# EAGLE design MCU_PCB_V2 (EAGLE 9.5.2)
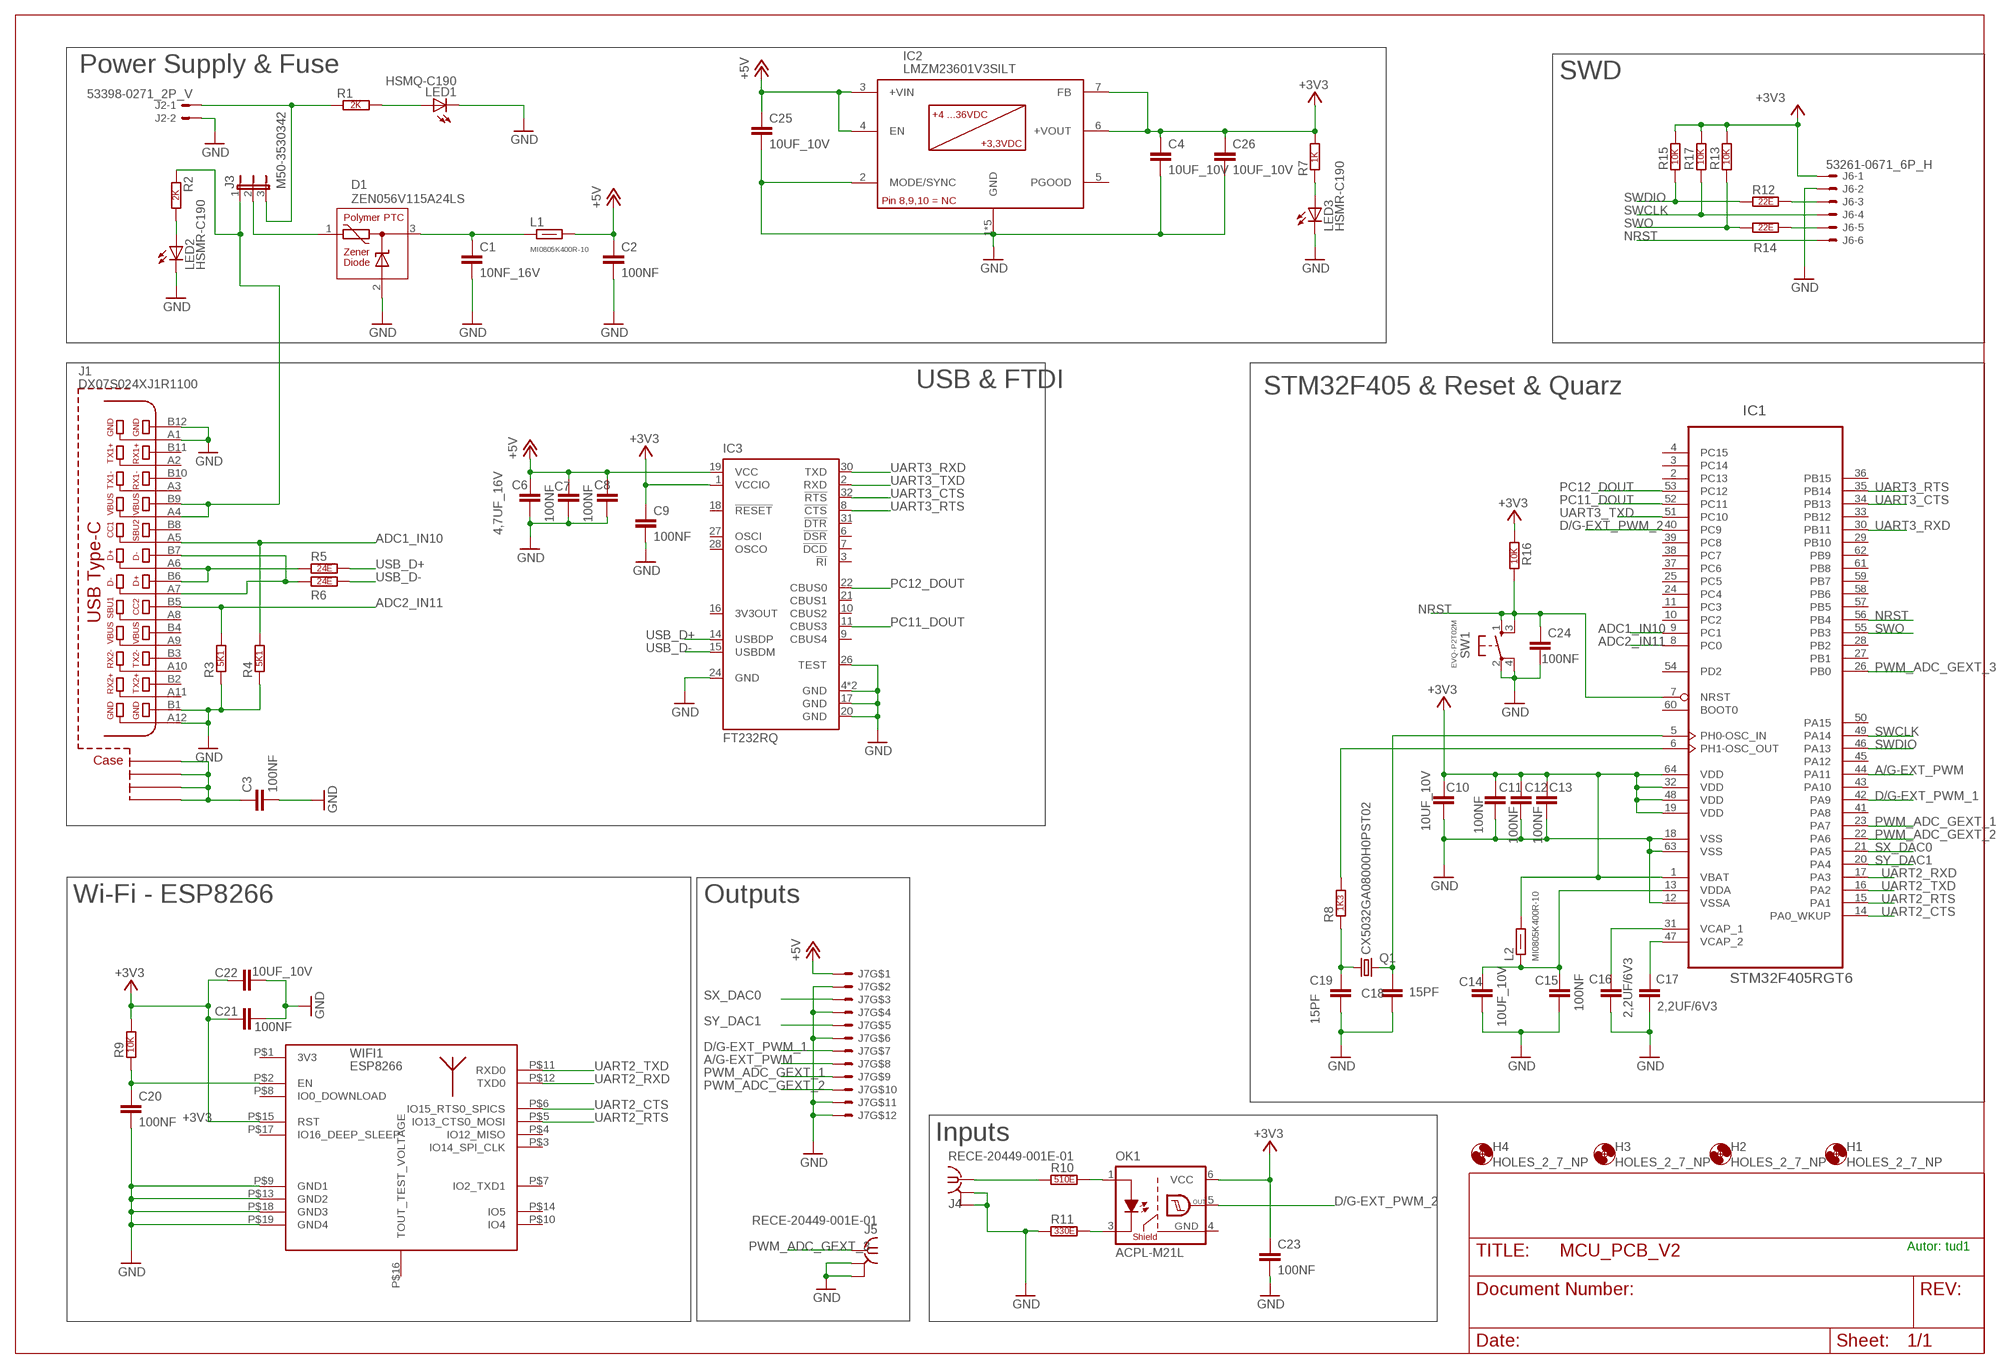
[diagram p0: schematic, sheet 1]

## Parts
C1  10NF_16V  [C0603]
C2  100NF  [C0402]
C3  100NF  [C0402]
C4  10UF_10V  [C0603]
C6  4,7UF_16V  [C0603]
C7  100NF  [C0402]
C8  100NF  [C0402]
C9  100NF  [C0402]
C10  10UF_10V  [C0603]
C11  100NF  [C0402]
C12  100NF  [C0402]
C13  100NF  [C0402]
C14  10UF_10V  [C0603]
C15  100NF  [C0402]
C16  2,2UF/6V3  [C0402]
C17  2,2UF/6V3  [C0402]
C18  15PF  [C0402]
C19  15PF  [C0402]
C20  100NF  [C0402]
C21  100NF  [C0402]
C22  10UF_10V  [C0603]
C23  100NF  [C0402]
C24  100NF  [C0402]
C25  10UF_10V  [C0603]
C26  10UF_10V  [C0603]
D1  ZEN056V115A24LS  [1616_LS]
H1  HOLES_2_7_NP  [2_7_NP]
H2  HOLES_2_7_NP  [2_7_NP]
H3  HOLES_2_7_NP  [2_7_NP]
H4  HOLES_2_7_NP  [2_7_NP]
IC1  STM32F405RGT6  [LQFP-64]
IC2  LMZM23601V3SILT  [USIP-10]
IC3  FT232RQ  [QFN32]
J1  DX07S024XJ1R1100  [USB-TYPE_C_JAE]
J2  53398-0271_2P_V  [53398-02]
J3  M50-3530342  [M50-3530342]
J4  RECE-20449-001E-01  [IPEX_MHF4]
J5  RECE-20449-001E-01  [IPEX_MHF4]
J6  53261-0671_6P_H  [53261-06]
J7  53261-7010_10P_H  [53261-10]
L1  MI0805K400R-10  [F0805]
L2  MI0805K400R-10  [F0805]
LED1  HSMQ-C190  [CHIP-LED-0603]
LED2  HSMR-C190  [CHIP-LED-0603]
LED3  HSMR-C190  [CHIP-LED-0603]
OK1  ACPL-M21L  [SO-5]
Q1  CX5032GA08000H0PST02  [CX5032GA]
R1  2K  [R0603]
R2  2K  [R0603]
R3  5K1  [R0603]
R4  5K1  [R0603]
R5  24E  [R0402]
R6  24E  [R0402]
R7  1K  [R0603]
R8  1K3  [R0402]
R9  10K  [R0402]
R10  510E  [R0402]
R11  330E  [R0402]
R12  22E  [R0402]
R13  10K  [R0402]
R14  22E  [R0402]
R15  10K  [R0402]
R16  10K  [R0402]
R17  10K  [R0402]
SW1  EVQ-P2T02M  [EVQ-P2T02M]
WIFI1  ESP8266  [ESP8266]

## Nets
+3V3: C4.1 C9.1 C10.1 C11.1 C12.1 C13.1 C21.1 C22.1 C23.1 C26.1 IC1.1(VBAT) IC1.19(VDD) IC1.32(VDD) IC1.48(VDD) IC1.64(VDD) IC2.6(+VOUT) IC2.7(FB) IC3.1(VCCIO) J6.1 L2.2 OK1.6(VCC) R7.2 R9.2 R13.2 R15.2 R16.1 R17.2 WIFI1.P$15(RST)
+5V: C2.1 C6.1 C7.1 C8.1 C25.1 IC2.3(+VIN) IC2.4(EN) IC3.19(VCC) J7.1 L1.2
A/G-EXT_PWM: IC1.44(PA11) J7.8
ADC1_IN10: IC1.9(PC1) J1.A5 R4.2
ADC2_IN11: IC1.8(PC0) J1.B5 R3.2
D/G-EXT_PWM_1: IC1.42(PA9) J7.7
D/G-EXT_PWM_2: IC1.40(PC9) OK1.5(OUT)
GND: C1.2 C2.2 C3.2 C4.2 C6.2 C7.2 C8.2 C9.2 C10.2 C11.2 C12.2 C13.2 C14.2 C15.2 C16.2 C17.2 C18.2 C19.2 C20.2 C21.2 C22.2 C23.2 C24.2 C25.2 C26.2 D1.2(GND) IC1.12(VSSA) IC1.18(VSS) IC1.63(VSS) IC2.1(GND) IC2.2(MODE/SYNC) IC2.GND@1(GND) IC2.GND@2(GND) IC2.GND@3(GND) IC2.GND@4(GND) IC3.4(GND) IC3.17(GND) IC3.20(GND) IC3.24(GND) IC3.26(TEST) IC3.GND@3(GND) J1.A1 J1.A12 J1.B1 J1.B12 J2.2 J4.2@1(GND) J4.2@2(GND) J4.NC(GND) J5.2@1(GND) J5.2@2(GND) J5.NC(GND) J6.2 J7.2 J7.4 J7.6 J7.S1 J7.S2 LED1.C LED2.C LED3.C R3.1 R4.1 R11.1 SW1.2(S) SW1.4(S) WIFI1.P$9(GND1) WIFI1.P$13(GND2) WIFI1.P$18(GND3) WIFI1.P$19(GND4)
N$1: J2.1 J3.3 R1.1
N$2: LED1.A R1.2
N$3: D1.1(VIN) J3.2
N$4: C1.1 D1.3(VOUT) L1.1
N$6: LED2.A R2.2
N$7: C16.1 IC1.31(VCAP_1)
N$9: J1.A6 J1.B6 R5.1
N$10: C17.1 IC1.47(VCAP_2)
N$11: C3.1 J1.C_FLEFT(S3) J1.C_FRIGHT(S1) J1.C_RLEFT(S4) J1.C_RRIGHT(S2)
N$12: J1.A7 J1.B7 R6.1
N$13: LED3.A R7.1
N$14: OK1.3(C) R11.2
N$15: C14.1 C15.1 IC1.13(VDDA) L2.1
N$16: C19.1 Q1.1 R8.1
N$17: C18.1 IC1.5(PH0-OSC_IN) Q1.2
N$18: OK1.1(A) R10.2
N$19: J1.A4 J1.B9 J3.1 R2.1
N$20: IC1.6(PH1-OSC_OUT) R8.2
N$21: J4.1 R10.1
N$23: J6.3 R12.2
N$25: J6.5 R14.2
NRST: C24.1 IC1.7(NRST) IC1.56(PB4) J6.6 R16.2 SW1.1(P) SW1.3(P)
PC11_DOUT: IC1.52(PC11) IC3.11(CBUS3)
PC12_DOUT: IC1.53(PC12) IC3.22(CBUS0)
PWM_ADC_GEXT_1: IC1.23(PA7) J7.9
PWM_ADC_GEXT_2: IC1.22(PA6) J7.10
PWM_ADC_GEXT_3: IC1.26(PB0) J5.1
SWCLK: IC1.49(PA14) J6.4 R17.1
SWDIO: IC1.46(PA13) R12.1 R15.1
SWO: IC1.55(PB3) R13.1 R14.1
SX_DAC0: IC1.21(PA5) J7.3
SY_DAC1: IC1.20(PA4) J7.5
UART2_CTS: IC1.14(PA0_WKUP) WIFI1.P$6(IO15_RTS0_SPICS)
UART2_RTS: IC1.15(PA1) WIFI1.P$5(IO13_CTS0_MOSI)
UART2_RXD: IC1.17(PA3) WIFI1.P$12(TXD0)
UART2_TXD: IC1.16(PA2) WIFI1.P$11(RXD0)
UART3_CTS: IC1.34(PB13) IC3.32(!RTS)
UART3_RTS: IC1.35(PB14) IC3.8(!CTS)
UART3_RXD: IC1.30(PB11) IC3.30(TXD)
UART3_TXD: IC1.51(PC10) IC3.2(RXD)
USB_D+: IC3.14(USBDP) R5.2
USB_D-: IC3.15(USBDM) R6.2
WIFI_RST: C20.1 R9.1 WIFI1.P$2(EN)
Unconnected: IC1.2(PC13) IC1.3(PC14) IC1.4(PC15) IC1.10(PC2) IC1.11(PC3) IC1.24(PC4) IC1.25(PC5) IC1.27(PB1) IC1.28(PB2) IC1.29(PB10) IC1.33(PB12) IC1.36(PB15) IC1.37(PC6) IC1.38(PC7) IC1.39(PC8) IC1.41(PA8) IC1.43(PA10) IC1.45(PA12) IC1.50(PA15) IC1.54(PD2) IC1.57(PB5) IC1.58(PB6) IC1.59(PB7) IC1.60(BOOT0) IC1.61(PB8) IC1.62(PB9) IC2.5(PGOOD) IC2.8(NC) IC2.9(NC) IC2.10(NC) IC3.3(!RI) IC3.6(!DSR) IC3.7(!DCD) IC3.9(CBUS4) IC3.10(CBUS2) IC3.16(3V3OUT) IC3.18(!RESET) IC3.21(CBUS1) IC3.27(OSCI) IC3.28(OSCO) IC3.31(!DTR) J1.A2 J1.A3 J1.A8 J1.A9 J1.A10 J1.A11 J1.B2 J1.B3 J1.B4 J1.B8 J1.B10 J1.B11 WIFI1.P$1(3V3) WIFI1.P$3(IO14_SPI_CLK) WIFI1.P$4(IO12_MISO) WIFI1.P$7(IO2_TXD1) WIFI1.P$8(IO0_DOWNLOAD) WIFI1.P$10(IO4) WIFI1.P$14(IO5) WIFI1.P$16(TOUT_TEST_VOLTAGE) WIFI1.P$17(IO16_DEEP_SLEEP)

## Notes on the sheet
- Power Supply & Fuse | SWD
- USB & FTDI | STM32F405 & Reset & Quarz
- Wi-Fi - ESP8266 | Outputs
- Inputs
- Autor: tud1

## Power pins joined to a net without a drawn wire
GND: OK1.4(GND)

## Library data of the parts
C1 = MCU_Print_V2:10NF_16V: Multilayer ceramic capacitor SMD, 10nF ±10%, 16VDC, X7R, Kemet, Case 0603, Mouser: 80-C0603C103K4RACTM; CASE: 0603; CERAMIC: X7R; MANUFACTURER: Kemet; MOUSER: 80-C0603C103K4RACTM; OPERATING_TEMPERATURE_RANGE: -55°C ~ 125°C; TOLERANCE: ±10%; TYPE: C0603C103K4RACTM; U_NOM: 16V
C2 C3 C7-C9 C11-C13 C15 C20 C21 C23 C24 = MCU_Print_V2:100NF: Ceramic capacitor SMD 100nF ±5%, 16VDC, X7R, Kemet, Case 0402, C0402C104J4RACTU, MLCC, Mouser: 80-C0402C104J4R; CASE: 0402; CERAMIC: X7R; FARNELL: 2429353; MANUFACTURER: Kemet; MOUSER: 80-C0402C104J4R; OPERATING-TEMPERATURE-RANGE: -55...+125 °C; PRODUCT: General Type MLCCs; TOLERANCE: ±5%; TYPE: C0402C104J4RACTU; U-NOM: 16VDC
C4 C10 C14 C22 C25 C26 = MCU_Print_V2:10UF_10V: Ceramic capacitor SMD 10uF ±10%, 10VDC, X5R, TDK , Case 0603, Mouser: 810-C1608X5R1A106K; CASE: 0603; CERAMIC: X5R; DIGI-KEY: 445-7486-1-ND; FARNELL: 2211164; MANUFACTURER: TDK; MOUSER: 810-C1608X5R1A106K; OPERATING_TEMPERATURE_RANGE: -55°C ~ 85°C; TOLERANCE: ±10%; TYPE: C1608X5R1A106K080AC; U_NOM: 10V
C6 = MCU_Print_V2:4,7UF_16V: Multilayer Ceramic Capacitors MLCC, SMD 4,7uF ±10%, 16VDC, X5R, YAGEO , Case 0603, Mouser: 603-CC603KRX5R7BB475; CASE: 0603; CERAMIC: X5R; DIGI-KEY: 311-1785-2-ND; MANUFACTURER: Yageo; MOUSER: 603-CC603KRX5R7BB475; OPERATING_TEMPERATURE_RANGE: -55°C ~ 85°C; TOLERANCE: ±10%; TYPE: CC0603KRX5R7BB475; U_NOM: 16V
C16 C17 = MCU_Print_V2:2,2UF/6V3: Multilayer Ceramic Capacitors MLCC, SMD, 2,2uF ±10%, 6,3VDC, X5R, Kemet, Case 0402, Mouser: 80-C0402C225K9P; CASE: 0402; CERAMIC: X5R; DISTRELEC: 110-95-530; FARNELL: 2442787; MANUFACTURER: Kemet; MOUSER: 80-C0402C225K9P; OPERATING-TEMPERATURE-RANGE: -55...+85 °C; PRODUCT: Multilayer Ceramic Capacitors MLCC; TOLERANCE: ±10%; TYPE: C0402C225K9PACTU; U-NOM: 16VDC
C18 C19 = MCU_Print_V2:15PF: Multilayer Ceramic Capacitors MLCC, SMD, 15pF, ±5%, 50VDC, COG, Kemet, Case 0402, Mouser: 80-C0402C150J5G; CASE: 0402; CERAMIC: COG; DIGI-KEY: 399-1014-1-ND; FARNELL: 1414577; MANUFACTURER: Kemet; MOUSER: 80-C0402C150J5G; OPERATING-TEMPERATURE-RANGE: -55...+125 °C; PRODUCT: Multilayer Ceramic Capacitors MLCC; TOLERANCE: ±5%; TYPE: C0402C150J5GACTU; U-NOM: 50VDC
D1 = MCU_Print_V2:ZEN056V: Polizen, Polymer Enhanced Zener Diode, 5,6V, PPTC/Zener SMD, Littelfuse, Mouser : 650-ZEN056V115A24LS; CASE: 1616 (4040 metric); DIGI-KEY: ZEN056V115A24LSCT-ND; IR-REVERSE: 100mA; MANUFACTURER: Littelfuse; MOUSER: 650-ZEN056V115A24LS; OPERATIN_TEMPERATURE: -40 to +85°C; PRODUCT_TYPE: Zener Diode; VZ_ZENER_VOLTAGE: 5.6V; ZENER_IMPEDANCE: 180 mOhms
H1-H4 = MCU_Print_V2:HOLES_2_7_NP: Hole D = 2,7mm
IC1 = MCU_Print_V2:STM32F405RGT6: ARM Microcontrollers - MCU ARM M4 1024 FLASH 168 Mhz 192kB SRAM, STMicroelectronics, LQFP64, STM32F405RGT6, Mouser : 511-STM32F405RGT6; ADC-RESOLUTION: 12 bit; DATA-RAM-TYPE: SRAM; FARNELL: 2064363; INTERFACE-TYPE: CAN, I2C, I2S, SPI, UART; MAX-CLOCK-FREQUENCY: 168 MHz; MPN: STM32F405RGT6; NUMBER-OF-ADC-CHANNELS: 16; NUMBER-OF-IOS: 51 I/O; NUMBER-OF-TIMERS-COUNTERS: 10 Timer; OPERATING-SUPPLY-VOLTAGE: 1.8 V to 3.6 V; OPERATING-TEMPERATURE-RANGE: -40°C ~ 85°C (TA); PACKAGE: LQFP-64; SUPPLIER: STMicroelectronics
IC2 = MCU_Print_V2:LMZM23601V3SILT: Non-Isolated DC/DC Converters, IN 4...36V, UOT+3,3VDC / 1A, Step-Down DC-DC Power Module in 3.8-mm x 3-mm, Package 10-uSiP,Texas Instruments, Mouser : 595-LMZM23601V3SILT; CASE: uSiP-10; DIGI-KEY: 296-49461-1-ND; EFFICIENCY: 81%; INPUT-VOLTAGE: 4 V to 36 V; MANUFACTURER: Texas Instruments; MOUSER: 595-LMZM23601V3SILT; NUMBER-OF-OUT: 1; OPERATING-TEMPERATURE-RANGE: -40 °C ~ 125 °C; OUT: +3,3VDC; OUT-CURRENT: 1A; PRODUCT-TYPE: Non-Isolated DC-DC Converters
IC3 = MCU_Print_V2:FT232R: USB Interface IC USB to Serial UART, Mouser : 895-FT232RQ (case 32-QFN) & Mouser : 895-FT232RL (case 28-SSOP); CASE: 32-QFN (5x5); DATA-RATE: 12 Mb/s; DIGI-KEY: 768-1008-1-ND; FARNELL: 1146033; INTERFACE_TYPE: UART; MANUFACTURER: FTDI; MFR_NO: FT232RQ-REEL; MOUSER: 895-FT232RQ; OPERATING_SUPPLY_VOLTAGE: 1.8 V to 5.25 V; OPERATING_TEMPERATURE: -40°C ~ 85°C; PRODUCT: USB Bridge Controllers; PRODUCT-TYPE: USB Interface IC; SPEED: Full Speed; STANDARD: USB 2.0; SUPPLY-SUPPLY-CURRENT: 25 mA; TYPE: Bridge, USB to UART
J1 = MCU_Print_V2:DX07S024XJ1R1100: USB connector HYBRID, SMD/THRU hole STD MNT, USB type C, Receptacle, female, 24 Contact, JAE Electronics, Mouser : 656-DX07S024SJ1R1100; BRAND: JAE Electronics; CONTACT-MATERIAL: Copper Alloy; CURRENT-RATING: 5A; DIGI-KEY: 670-2848-1-ND; INSULATION-RESISTANCE: 100 MOhms; MANUFACTURER: JAE Electronics; MFR_NO: DX07S024XJ1R1100; MOUNTING-ANGLE: Right angle; MOUSER: 656-DX07S024SJ1R1100; NUMBER_CONTACT: 24; NUMBER_PORT: 1; OPERATING-TEMPERATURE: -30°C ~ 80°C; PRODUCT: USB Type C Connectors; SHELL-PLATING: Nickel; SPECIFICATIONS: USB 3.1 (USB 3.1 Gen 2, Superspeed+); VOLTAGE-RATING: 20V
J2 = MCU_Print_V2:53398-0271_2P_V: Pin header, PicoBlade 2-pin SMD, 53398-0271, Molex, single row straight, Distrelec : 143-54-189; CABLE_ASSEMBLY_31565: 143-54-490; CONTACT_MATERIAL: Tin-plated phosphor bronze; CONTACT_RESISTANCE: 20mOhm; CRIMP_SOCKET_FEMALE_32-28AWG_50058-8100: Distrelec : 143-00-962; CRIMP_SOCKET_FEMALE__28-26AWG_50079-8100: Distrelec : 143-00-964; DESIGN: Pin strip, single row straight, SMD; DISTRELEC: 143-54-189; MANUFACTURER: Molex; MOUSER: 538-53398-0271; PITCH: 1,25mm; POLE-NO: 2; RATED-CURRENT: 1A; RATED-VOLTAGE: 125VAC; SERIES: PicoBlade; SOCKET_51021-0200: Distrelec : 143-54-361
J3 = MCU_Print_V2:M50-3530342: Single row 1.27 mm, 3 pin's, Straight solder tail, Square pin diam. 0.4 mm, Mouser : 855-M50-3530342; CONTACT-MATERIAL: Brass; CONTACT_GENDER: Pin (Male); CONTACT_PLATING: Gold; CURRENT-RATING: 1A; DIGI-KEY: 952-3599-ND; FLAMABILITY_RATING: UL 94 V-0; HOUSING-MATERIAL: Polyamide (PA); INSULATION-RESISTANCE: 1 GOhms; MANUFACTURER: Harwin; MATING-POST-LENGHT: 3 mm; MFR_NO: M50-3530342; MOUNTING_ANGLE: Straight; MOUNTING_STYLE: Straight Pin; MOUSER: 855-M50-3530342; NUMBER_OF_POSITION: 3; NUMBER_OF_ROW: 1; OPERATING-TEMPERATURE: -40 °C ~ 105 °C; PITCH: 1,27mm; PRODUCTS: Headers; TERMINATION-POST-LENGHT: 2.3mm; TERMINATION_STYLE: Through Hole; TYPE: Pin Strip
J4 J5 = MCU_Print_V2:RECE-20449-001E-01: RF Connectors / Coaxial Connectors Onboard Receptacle IPEX MHF4, straight, SMD, Jack, Mouser : 960-RECE20449-001E01; ALIASES: RECE.20449.001E-01; BRAND: Taoglas; CONTACT_MATERIAL: Brass; CONTACT_PLATING: Gold; DIGI-KEY: 931-1158-2-ND; MOUSER: 960-RECE20449-001E01; ORIENTATION: Straight; PRODUCT: PCB Receptacles; PRODUCT_TYPE: RF Connectors / Coaxial Connectors; SERIES: RECE; TERMINATION_STYLE: SMD/SMT
J6 = MCU_Print_V2:53261-0671_6P_H: Pin header, PicoBlade 6-pin SMD, 53261-0671, Molex, single row 90°, Distrelec : 143-54-312; CABLE_ASSEMBLY_31564: Distrelec : 143-54-488; CONTACT_MATERIAL: Tin-plated phosphor bronze; CONTACT_RESISTANCE: 20mOhm; CRIMP_SOCKET_FEMALE_32-28AWG_50058-8100: Distrelec : 143-00-962; CRIMP_SOCKET_FEMALE__28-26AWG_50079-8100: Distrelec : 143-00-964; DESIGN: Pin strip, single row 90° SMD; MANUFACTURER: Molex; MOUSER: 538-53261-0671; PITCH: 1,25mm; POLE_NO: 6; RATED_CURRENT: 1A; RATED_VOLTAGE: 125VAC; SERIES: PicoBlade; SOCKET_51021-0600: Distrelec : 143-54-403
J7 = MCU_Print_V2:53261-7010_10P_H: Pin header, PicoBlade 6-pin SMD, 53261-0671, Molex, single row 90°, Distrelec : 143-54-312; MANUFACOR: MOLEX; MOUSER: 538-53261-7010
L1 L2 = MCU_Print_V2:MI0805K400R-10: Ferrite Beads 40ohms, 100MHz, 1.5A, Monolithic, case 0805, Mouser : 875-MI0805K400R-10; CASE: 0805; DIGI-KEY: 240-2389-1-ND; FARNELL: 2292459; IMPEDANCE: 40 Ohms; MANUFACTURER: Laird; MAXIMUM_DC_CURRENT: 1.5 A; MAX_DC_RESISTANCE: 50 mOhms; MFR_NO: MI0805K400R-10; MOUSER: 875-MI0805K400R-10; OPERATING-TEMPERATURE: -40°C ~ 125°C; PRODUCT_CATEGORY: Ferrite Beads; TYPE: Differential Mode Ferrite Chip Bead Power
LED1 = MCU_Print_V2:HSMQ-C190: SMD LED Green, HSMQ-C190, Broadcom Limited, Package 0603, Light colour green, Mouser : 630-HSMQ-C190; CASE: 0603; COLOR: Green; FARNELL: 2917791; IF: 20mA; LUMINOUS-INTENSITY: 145 mcd; MANUFACTURER: Broadcom Limited; MOUSER: 630-HSMQ-C190; OPERATING-TEMPERATURE-RANG: -40...+85 °C; POWER-RATING: 78mW; VF: 3,4V; VIEWING-ANGLE: 140 deg; VR: 5V; WAVELENGTH: 520nm
LED2 LED3 = MCU_Print_V2:HSMR-C190: SMD LED blue, HSMR-C190, Broadcom Limited, Package 0603, Light colour blue, Mouser : 630-HSMR-C190; CASE: 0603; COLOR: Blue; FARNELL: 1652108; IF: 20mA; LUMINOUS-INTENSITY: 55 mcd; MANUFACTURER: Broadcom Limited; MOUSER: 630-HSMR-C190; OPERATING-TEMPERATURE-RANG: -40...+85 °C; POWER-RATING: 78mW; VF: 3,4V; VIEWING-ANGLE: 140 deg; VR: 5V; WAVELENGTH: 473nm
OK1 = MCU_Print_V2:ACPL-M21L: High Speed Optocouplers Optocoupler 5MBd, case SO-5, Avago, Mouser : 630-ACPL-M21L-500E; CASE: SO-5; DATA-RATE: 5 Mbps; FARNELL: 2213628; IF: 2.2 mA; INSOLATION-VOLTAGE: 3750 Vrms; MANUFACTURER: Broadcom Limited; MOUSER: 630-ACPL-M21L-500E; NUMBER-OF-CHANNELS: 1; OPERATING-TEMPERATURE: -40°C ~ 105°C; OPERATING-VOLTAGE: 2.7 V to 5.5 V; OUT-CURRENT: 10mA; OUT-TYPE: Photo IC; PRODUCT: High Speed Optocouplers; RISE-TIME: 11ns; VF: 1.5 V; VR: 5V
Q1 = MCU_Print_V2:CX5032GA08000H0PST02: SMD Crystals, 8MHz, 12pF, 50ppm, Kyocera, Mouser : 581-CX5032GA08H0PST; CASE: 5 mm x 3.2 mm; DIGI-KEY: 1253-1691-1-ND; DRIVE-LEVEL: 500 uW; ESR: 200 Ohm; FREQUENCY: 8 MHz; FREQUENCY-STABILITY: 100 PPM; LOAD_CAPACITANCE: 12 pF; MANUFACTURER: Kyocera; MFR_NO: CX5032GA08000H0PST02; MOUSER: 581-CX5032GA08H0PST; OPERATING-TEMPERATURE: -40°C ~ 125°C; QUALIFICATION: AEC-Q200; TOLERANCE: 50 PPM; TYPE: SMD Crystal
R1 R2 = MCU_Print_V2:2K: ±Resistor SMD 2 kΩ 1 %, ERJ-3EKF2001V, Panasonic, Case 0603, Mouser : 667-ERJ-3EKF2001V; CASE: 0603; DISTRELEC: 300-37-855; MANUFACTURER: Panasonic; MOUSER: 667-ERJ-3EKF2001V; POWER: 0,1W; TEMPERATURE_COEFFICIENT: 100 ppm/°C; TOLERANCE: ±1%; TYPE: ERJ-3EKF2001V; VOLTAGE: 75VDC
R3 R4 = MCU_Print_V2:5K1: ±Resistor SMD 5,1 kΩ, 1 %, 0,1W, ERJ-3EKF5101V, Panasonic, Case 0603, Mouser : 667-ERJ-3EKF5101V; CASE: 0603; DISTRELEC: 300-37-965; FARNELL: 2059378; MANUFACTURER: Panasonic; MOUSER: 667-ERJ-3EKF5101V; POWER: 0,1W; TEMPERATURE_COEFFICIENT: 100 ppm/°C; TOLERANCE: ±1%; TYPE: ERJ-3EKF5101V; VOLTAGE: 75VDC
R5 R6 = MCU_Print_V2:24E: ±Resistor SMD 24Ω, 1 %, 100mW 50V, ERJ-2RKF24R0X, Panasonic, Case 0402, Mouser : 667-ERJ-2RKF24R0X; CASE: 0402; FARNELL: 2302458; MANUFACTURER: Panasonic; MOUSER: 667-ERJ-2RKF24R0X; OPERATING-TEMPERATURE-RANGE: - 55 C to + 155 C; POWER: 100mW; TEMPERATURE_COEFFICIENT: 100 PPM / C; TOLERANCE: ±1%; TYPE: ERJ-2RKF24R0X; VOLTAGE: 50V
R7 = MCU_Print_V2:1K: ±Resistor SMD 1 kΩ, 1 %, 0,1W, ERJ-3EKF1001V , Panasonic, Case 0603, Mouser : 667-ERJ-3EKF1001V; CASE: 0603; DIGI-KEY: P1.00KHCT-ND; MANUFACTURER: Panasonic; MFR-NO: ERJ-3EKF1001V; MOUSER: 667-ERJ-3EKF1001V; POWER: 0,1W; TEMPERATURE_COEFFICIENT: 100 ppm/°C; TOLERANCE: ±1%; VOLTAGE: 75VDC
R8 = MCU_Print_V2:1K3: ±Resistor SMD 1,3 kΩ 1 % 100mW 50V, ERJ-2RKF1301X, Panasonic, Case 0402, Mouser : 667-ERJ-2RKF1301X; CASE: 0402; DISTRELEC: 300-37-644; FARNELL: 2059130; MANUFACTURER: Panasonic; MOUSER: 667-ERJ-2RKF1301X; OPERATING-TEMPERATURE-RANGE: - 55 C to + 155 C; POWER: 100mW; TEMPERATURE_COEFFICIENT: 100 PPM / C; TOLERANCE: ±1%; TYPE: ERJ-2RKF1301X; VOLTAGE: 50V
R9 R13 R15-R17 = MCU_Print_V2:10K: ±Resistor SMD 10KΩ, 1 %, 100mW 50V, ERJ-2RKF1002X, Panasonic, Case 0402, Mouser : 667-ERJ-2RKF1002X; CASE: 0402; DISTRELEC: 300-37-626; FARNELL: 2302739; MANUFACTURER: Panasonic; MOUSER: 667-ERJ-2RKF1002X; OPERATING-TEMPERATURE-RANGE: - 55 C to + 155 C; POWER: 100mW; TEMPERATURE_COEFFICIENT: 100 PPM / C; TOLERANCE: ±1%; TYPE: ERJ-2RKF1002X; VOLTAGE: 50V
R10 = MCU_Print_V2:510E: ±Resistor SMD 510Ω, 1 %, 100mW 50V, ERJ-2RKF5100X, Panasonic, Case 0402, Mouser : 667-ERJ-2RKF5100X; CASE: 0402; DISTRELEC: 300-37-749; FARNELL: 2302602; MANUFACTURER: Panasonic; MOUSER: 667-ERJ-2RKF5100X; OPERATING-TEMPERATURE-RANGE: - 55 C to + 155 C; POWER: 100mW; TEMPERATURE_COEFFICIENT: 100 PPM / C; TOLERANCE: ±1%; TYPE: ERJ-2RKF5100X; VOLTAGE: 50V
R11 = MCU_Print_V2:330E: ±Resistor SMD 330Ω, 1 %, 100mW 50V, ERJ-2RKF3300X, Panasonic, Case 0402, Mouser : 667-ERJ-2RKF3300X; CASE: 0402; DISTRELEC: 300-37-708; FARNELL: 2302581; MANUFACTURER: Panasonic; MOUSER: 667-ERJ-2RKF3300X; OPERATING-TEMPERATURE-RANGE: - 55 C to + 155 C; POWER: 100mW; TEMPERATURE_COEFFICIENT: 100 PPM / C; TOLERANCE: ±1%; TYPE: ERJ-2RKF3300X; VOLTAGE: 50V
R12 R14 = MCU_Print_V2:22E: ±Resistor SMD 24Ω, 1 %, 100mW 50V, ERJ-2RKF24R0X, Panasonic, Case 0402, Mouser : 667-ERJ-2RKF24R0X; CASE: 0402; MANUFACTURER: Vishey; MOUSER: 71-CRCW010022R0FREL; OPERATING-TEMPERATURE-RANGE: - 55 C to + 125 C; POWER: 30mW; TEMPERATURE_COEFFICIENT: 250 PPM / C; TOLERANCE: ±1%; TYPE: CRCW010022R0FREL; VOLTAGE: 15V
SW1 = MCU_Print_V2:EVQ-P2T02M: Tactile Switches FLAT ACT 2.4NF 4.7x3.5x2.1mm, Panasonic, EVQ-P2T02M, Mouser : 667-EVQ-P2T02M; CURRENT-RATING: 20mA; DIGI-KEY: P11082SCT-ND; FARNELL: 2459541; MANUFACTURER: Panasonic; MOUSER: 667-EVQ-P2T02M; OPERATING-FORCE: 2.4N; OPERATING-TEMPERATURE-RANGE: 40 C to + 85 C; PRODUCT: Tactile Switches; SWITCH-FONCTION: OFF - (ON); TYPE: EVQ-P2T02M; VOLTAGE-RATING: 15 VDC
WIFI1 = MCU_Print_V2:ESP8266; FREQUENCY_BAND: 2.4GHz; MANUFACTOR: Espressif System; MOUSER: 356-ESPWROOM-02D; POWER: 170mA; PRICE: 2.93CHF; SUPPLY_VOLTAGE: 3.3V

## Net classes
0 default: width 0.15 mm, drill 0.15 mm, clearance 0.15 mm

## Board
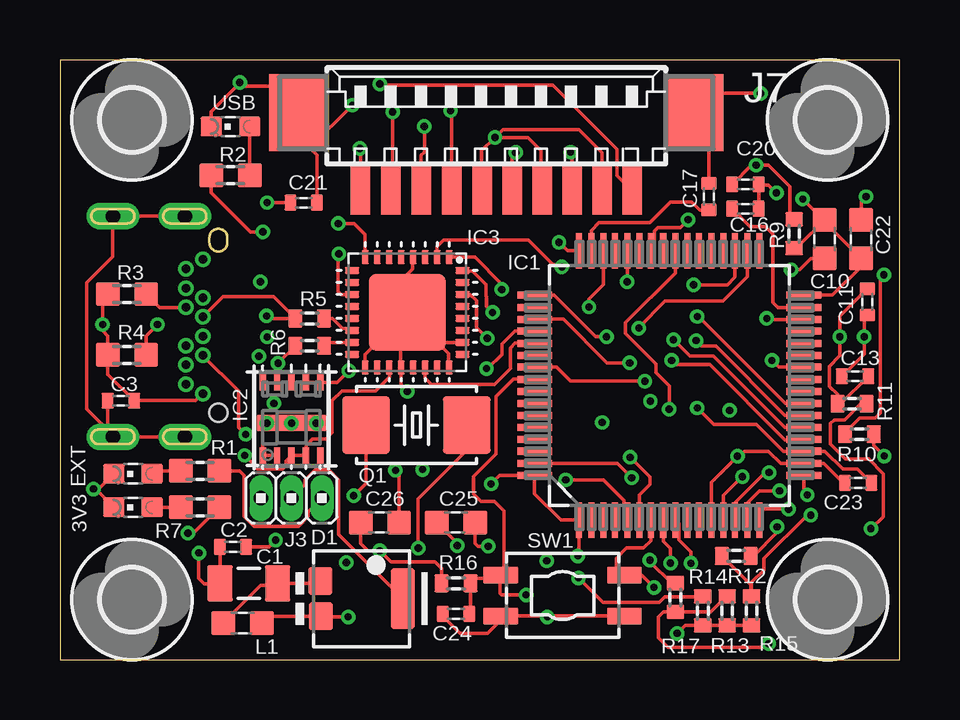
[diagram p1: board, top side]
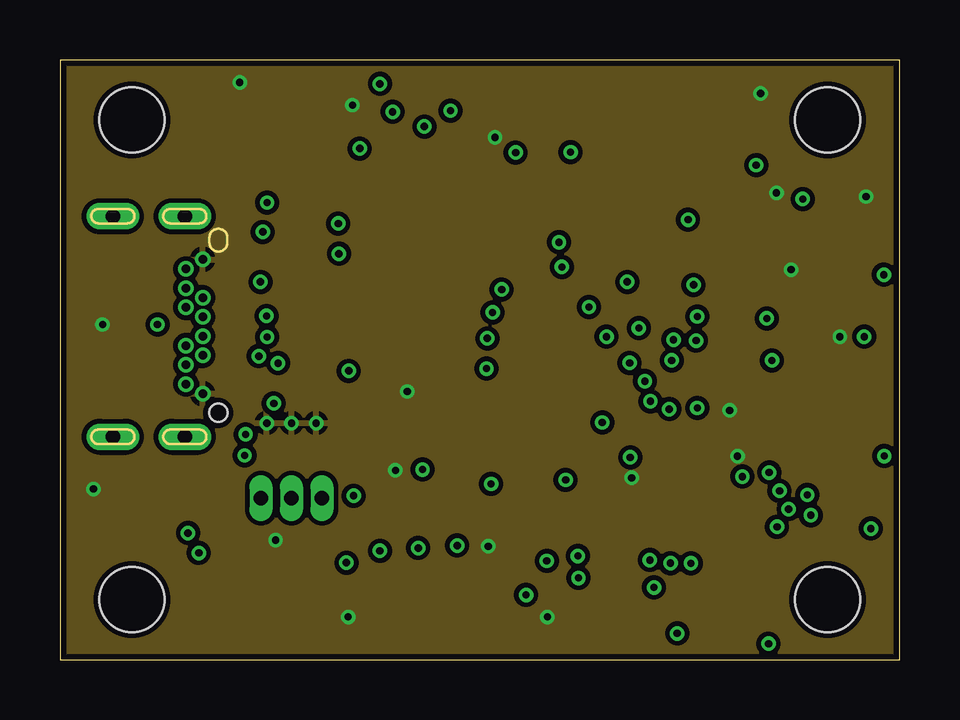
[diagram p2: board, inner layer Route2]
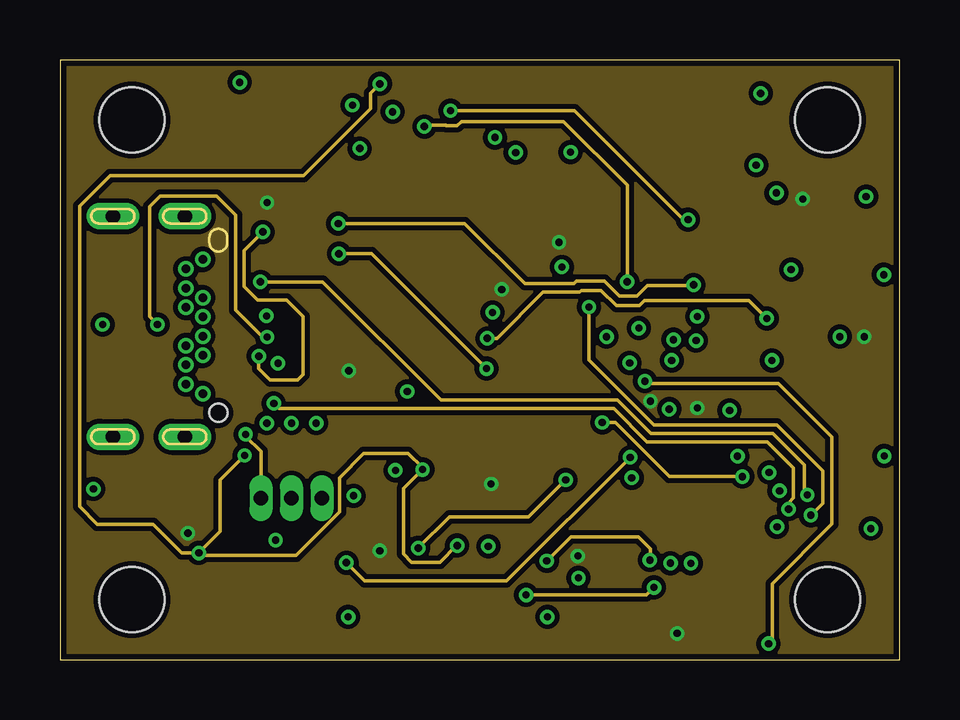
[diagram p3: board, inner layer Route15]
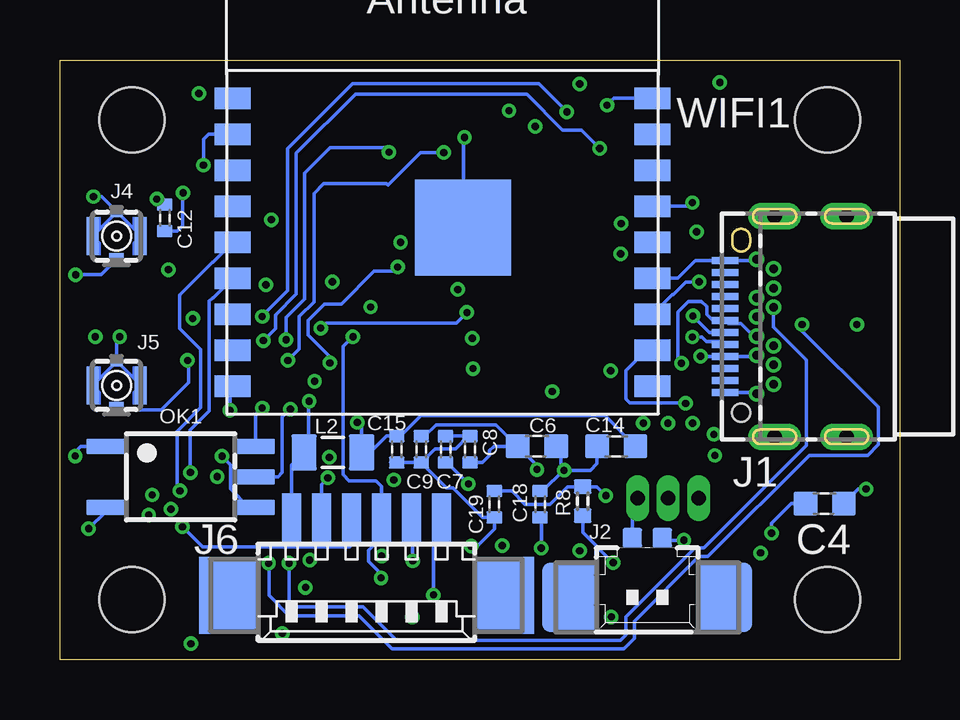
[diagram p4: board, bottom side, seen from below]

Size 35 x 25 mm. Coordinates in mm from the lower left corner, seen from the top.
Outline: 0,0 35,0 35,25 0,25 0,0
Copper layers (1+2*15+16): Top 0.018mm / dielectric 0.36mm / Route2 0.035mm / dielectric 0.71mm / Route15 0.035mm / dielectric 0.2mm / Bottom 0.018mm
Design rules "eC_4Layer_PClass8_BaseCopperO18-I18_MCU_PCB *": minimum track width 0.1mm, minimum drill 0.2mm, track to track 0.2mm, track to pad 0.125mm, pad to pad 0.125mm, via to via 0.125mm, smd to smd 0mil, copper to edge 0.25mm, drill to drill 0.35mm, minimum pad ring 0.15mm, minimum via ring 0.125mm, stop-mask expansion 0mil, vias tented up to drill 0.45mm, thermal gap 0.2mm

### Footprints (pad centres in the part's own frame; a part is rotated, then mirrored left to right if it is on the bottom)
C0603 = smd 1 x 1: 1 -0.8,0; 2 0.8,0
C0402 = smd 0.5 x 0.65: 1 -0.55,0; 2 0.55,0
1616_LS = smd 1 x 2.5: 1 -1.72,0 | smd 1 x 1.14: 2 1.7,0.735; 3 1.72,-0.735
2_7_NP = hole 2.7: 0,0
LQFP-64 = smd 1.473 x 0.279: 1 -5.613,3.759; 2 -5.613,3.251; 3 -5.613,2.743; 4 -5.613,2.261; 5 -5.613,1.753; 6 -5.613,1.245; 7 -5.613,0.762; 8 -5.613,0.254; 9 -5.613,-0.254; 10 -5.613,-0.762; 11 -5.613,-1.245; 12 -5.613,-1.753; 13 -5.613,-2.261; 14 -5.613,-2.743; 15 -5.613,-3.251; 16 -5.613,-3.759; 33 5.613,-3.759; 34 5.613,-3.251; 35 5.613,-2.743; 36 5.613,-2.261; 37 5.613,-1.753; 38 5.613,-1.245; 39 5.613,-0.762; 40 5.613,-0.254; 41 5.613,0.254; 42 5.613,0.762; 43 5.613,1.245; 44 5.613,1.753; 45 5.613,2.261; 46 5.613,2.743; 47 5.613,3.251; 48 5.613,3.759 | smd 0.279 x 1.473: 17 -3.759,-5.613; 18 -3.251,-5.613; 19 -2.743,-5.613; 20 -2.261,-5.613; 21 -1.753,-5.613; 22 -1.245,-5.613; 23 -0.762,-5.613; 24 -0.254,-5.613; 25 0.254,-5.613; 26 0.762,-5.613; 27 1.245,-5.613; 28 1.753,-5.613; 29 2.261,-5.613; 30 2.743,-5.613; 31 3.251,-5.613; 32 3.759,-5.613; 49 3.759,5.613; 50 3.251,5.613; 51 2.743,5.613; 52 2.261,5.613; 53 1.753,5.613; 54 1.245,5.613; 55 0.762,5.613; 56 0.254,5.613; 57 -0.254,5.613; 58 -0.762,5.613; 59 -1.245,5.613; 60 -1.753,5.613; 61 -2.261,5.613; 62 -2.743,5.613; 63 -3.251,5.613; 64 -3.759,5.613
USIP-10 = smd 0.65 x 0.3: 1 -1.525,1.2; 2 -1.525,0.6; 3 -1.525,0; 4 -1.525,-0.6; 5 -1.525,-1.2; 6 1.525,-1.2; 7 1.525,-0.6; 8 1.525,0; 9 1.525,0.6; 10 1.525,1.2 | smd 0.7 x 2.9: GND@1 -0.175,0 | drill 0.3: GND@2 -0.175,1.03; GND@3 -0.175,0; GND@4 -0.175,-1.03
QFN32 = smd 0.6 x 0.3: 1 -2.3,1.75; 2 -2.3,1.25; 3 -2.3,0.75; 4 -2.3,0.25; 5 -2.3,-0.25; 6 -2.3,-0.75; 7 -2.3,-1.25; 8 -2.3,-1.75; 17 2.3,-1.75; 18 2.3,-1.25; 19 2.3,-0.75; 20 2.3,-0.25; 21 2.3,0.25; 22 2.3,0.75; 23 2.3,1.25; 24 2.3,1.75 | smd 0.3 x 0.6: 9 -1.75,-2.3; 10 -1.25,-2.3; 11 -0.75,-2.3; 12 -0.25,-2.3; 13 0.25,-2.3; 14 0.75,-2.3; 15 1.25,-2.3; 16 1.75,-2.3; 25 1.75,2.3; 26 1.25,2.3; 27 0.75,2.3; 28 0.25,2.3; 29 -0.25,2.3; 30 -0.75,2.3; 31 -1.25,2.3; 32 -1.75,2.3 | smd 3.2 x 3.2: GND@3 0,0
USB-TYPE_C_JAE = smd 0.3 x 1.1: A1 0.85,0.66; A2 1.35,0.66; A3 1.85,0.66; A4 2.35,0.66; A5 2.85,0.66; A6 3.35,0.66; A7 3.85,0.66; A8 4.35,0.66; A9 4.85,0.66; A10 5.35,0.66; A11 5.85,0.66; A12 6.35,0.66 | drill 0.35 pad 0.65: B1 6.4,-0.65; B2 6,-1.35; B3 5.2,-1.35; B4 4.8,-0.65; B5 4.4,-1.35; B6 4,-0.65; B7 3.2,-0.65; B8 2.8,-1.35; B9 2.4,-0.65; B10 2,-1.35; B11 1.2,-1.35; B12 0.8,-0.65 | drill 0.6 pad 1.1 long: C_FLEFT -1,-4.4; C_FRIGHT 8.2,-4.4; C_RLEFT -1,-1.4; C_RRIGHT 8.2,-1.4 | hole 0.75: 0,0
53398-02 = smd 0.8 x 0.8: 1 0.625,-1.8; 2 -0.625,-1.8 | smd 2.3 x 2.9: S1 3.225,0.69; S2 -3.225,0.69
M50-3530342 = drill 0.6 pad 0.95 long: 1 -1.27,0; 2 0,0; 3 1.27,0
IPEX_MHF4 = smd 0.6 x 0.55: 1 0,-0.975 | smd 0.5 x 1.58: 2@1 -1,0; 2@2 1,0 | smd 0.5 x 0.46: NC 0,1.02
53261-06 = smd 0.8 x 2: 1 3.125,-2.5; 2 1.875,-2.5; 3 0.625,-2.5; 4 -0.625,-2.5; 5 -1.875,-2.5; 6 -3.125,-2.5 | smd 2.4 x 3.2: S1 5.775,0.75; S2 -5.775,0.75
53261-10 = smd 0.8 x 2: 1 5.665,-2.5; 2 4.415,-2.5; 3 3.165,-2.5; 4 1.915,-2.5; 5 0.665,-2.5; 6 -0.585,-2.5; 7 -1.855,-2.5; 8 -3.125,-2.5; 9 -4.395,-2.5; 10 -5.665,-2.5 | smd 2.4 x 3.2: S1 8.275,0.75; S2 -8.275,0.75
F0805 = smd 1.05 x 1.5: 1 -1.2,0; 2 1.2,0
CHIP-LED-0603 = smd 0.8 x 0.9: A 0,-0.8; C 0,0.8
SO-5 = smd 0.64 x 1.6: 1 -1.27,-3.13; 3 1.27,-3.13; 4 1.27,3.13; 5 0,3.13; 6 -1.27,3.13
CX5032GA = smd 2 x 2.4: 1 -2.1,0; 2 2.1,0
R0603 = smd 1 x 1: 1 -0.8,0; 2 0.8,0
R0402 = smd 0.6 x 0.75: 1 -0.6,0; 2 0.6,0
EVQ-P2T02M = smd 0.7 x 1.45: 1 -0.85,2.575; 2 0.85,2.575; 3 -0.85,-2.575; 4 0.85,-2.575
ESP8266 = smd 1.5 x 0.9: P$1 -8.75,6; P$2 -8.75,4.5; P$3 -8.75,3; P$4 -8.75,1.5; P$5 -8.75,0; P$6 -8.75,-1.5; P$7 -8.75,-3; P$8 -8.75,-4.5; P$9 -8.75,-6; P$10 8.75,-6; P$11 8.75,-4.5; P$12 8.75,-3; P$13 8.75,-1.5; P$14 8.75,0; P$15 8.75,1.5; P$16 8.75,3; P$17 8.75,4.5; P$18 8.75,6 | smd 4 x 4: P$19 0.85,0.61

### Placement (x,y rotation side)
C1  7.62,1.52 0 top
C2  7.21,4.7 0 top
C3  2.54,10.79 0 top
C4  3.12,6.5 0 bottom
C6  15.11,8.89 0 bottom
C7  19.94,8.76 270 bottom
C8  17.91,8.76 90 bottom
C9  18.92,8.76 90 bottom
C10  31.88,17.53 270 top
C11  33.66,14.91 90 top
C12  30.63,18.41 270 bottom
C13  33.15,11.81 0 top
C14  11.81,8.89 180 bottom
C15  20.95,8.76 270 bottom
C16  28.57,18.8 0 top
C17  27.05,19.3 90 top
C18  14.99,6.48 90 bottom
C19  16.89,6.48 270 bottom
C20  28.57,19.81 0 top
C21  10.16,19.05 0 top
C22  33.4,17.53 90 top
C23  33.27,7.37 180 top
C24  16.51,1.91 180 top
C25  16.51,5.71 0 top
C26  13.34,5.71 0 top
D1  12.57,2.54 180 top
H1  32,2.5 0 top
H2  3,2.5 0 top
H3  32,22.5 0 top
H4  3,22.5 0 top
IC1  25.4,11.43 90 top
IC2  9.65,10.03 90 top
IC3  14.48,14.48 270 top
J1  6.6,10.29 90 bottom
J2  10.52,3.28 180 bottom
J3  9.65,6.73 0 top
J4  32.64,17.65 0 bottom
J5  32.64,11.43 0 bottom
J6  22.23,3.43 180 bottom
J7  18.19,22.05 0 top
L1  7.87,3.17 180 top
L2  23.62,8.64 180 bottom
LED1  3.05,7.75 90 top
LED2  7.11,22.23 90 top
LED3  3.05,6.35 90 top
OK1  29.97,7.62 270 bottom
Q1  14.86,9.78 0 top
R1  5.84,7.87 180 top
R2  7.11,20.19 0 top
R3  2.79,15.24 0 top
R4  2.79,12.7 0 top
R5  10.41,14.22 0 top
R6  10.41,13.08 0 top
R7  5.84,6.35 0 top
R8  13.21,6.6 270 bottom
R9  30.61,17.75 270 top
R10  33.32,9.4 0 top
R11  33.02,10.67 0 top
R12  28.19,4.32 0 top
R13  27.81,2.03 270 top
R14  25.65,2.59 90 top
R15  28.83,2.03 270 top
R16  16.51,3.17 0 top
R17  26.8,2.03 270 top
SW1  20.95,2.67 270 top
WIFI1  19.05,17.4 0 bottom

### Tracks (layer width: path | path; a pad name or v marks a point on that pad's centre or on a via)
+3V3  (via drill 0.3 pad 0.6)
  Top 0.152: C21.1 v8.64,19.05 | IC2.7 IC2.6 11.56,11.56 v12.04,12.04 | R7.2 5.56,5.27 v5.33,5.27 | C26.1 12.54,4.85 12.85,4.54 v13.34,4.54 13.8,4.07 15.64,4.07 15.91,3.79 R16.1 | 16.34,16.89 IC3.1 17.29,16.78 18.41,15.66 v18.41,15.43 | R9.2 30.61,17.27 30.82,17.27 C10.1 | C10.1 31.88,18.25 C22.1 33.4,16.38 32.21,15.19 IC1.32 | C11.1 33.53,14.23 v33.53,13.46 33.53,12.74 C13.1 | 27.81,1.59 R13.2 | v17.97,7.33 18.32,7.67 IC1.64 19.79,6.91 20.88,5.82 21.36,5.82 IC1.1 21.64,4.37 v21.59,4.32 | R15.2 R13.2 | R13.2 R17.2 26.07,1.43 v25.73,1.09 | C23.1 33.24,7.95 32.63,7.95 31.89,8.69 IC1.19 30.15,8.69 29.03,9.8 27.25,9.8 v26.57,10.49 | IC1.48 21.16,17.04 v20.8,17.4 | C10.1 31.84,18.33 v30.96,19.2
  Bottom 0.152: J6.1 25.35,8.11 L2.2 24.64,8.81 24.64,10.74 v24.61,10.77 | C9.1 18.86,8.21 v17.97,7.33 | v30.96,19.2 30.73,18.96 C12.1 | OK1.6 26.84,10.22 v26.57,10.49 | WIFI1.P$15 8.79,18.9 v8.64,19.05 | C4.1 4.51,6.5 5.33,5.68 v5.33,5.27
  pour Route15: 0,24.89 0,0 35.05,0 35.05,24.89
+5V  (via drill 0.3 pad 0.6)
  Top 0.152: C2.1 6.67,4.69 L1.2 6.65,3.15 6.02,3.15 5.79,3.38 v5.79,4.45 | IC3.19 13.73,11.79 13.15,11.21 11.75,11.21 11.35,10.81 11.35,9.46 11.09,9.2 10.54,9.2 10.25,8.91 IC2.4 IC2.3 9.43,8.28 9.43,8.1 9.29,7.96 8.22,7.96 8.08,8.1 8.08,8.13 v7.7,8.51 | J7.1 23.23,20.17 23.23,21.28 20.55,23.95 13.34,23.95 v13.34,24 | C25.1 16.56,4.86 v16.56,4.75
  Route15 0.152: v13.34,24 12.95,23.61 12.95,22.96 10.16,20.18 2.09,20.18 0.81,18.9 0.81,6.38 1.55,5.64 3.89,5.64 5.08,4.45 v5.79,4.45 | v16.56,4.75 16.54,4.75 15.84,4.06 14.67,4.06 14.33,4.4 14.33,7.14 v15.11,7.92 15.11,8 14.52,8.6 12.67,8.6 11.65,7.58 11.65,6.15 9.85,4.34 5.89,4.34 v5.79,4.45 | v5.79,4.45 6.68,5.33 6.68,7.49 v7.7,8.51
  Bottom 0.152: C6.1 15.91,8.88 16.82,9.79 19.32,9.79 19.8,9.31 C7.1 | C6.1 16.92,8.89 17.09,8.71 17.09,8.51 17.39,8.21 C8.1 | C6.1 15.11,8.09 v15.11,7.92
A/G-EXT_PWM  (via drill 0.3 pad 0.6)
  Top 0.152: IC1.44 v23.65,15.75 | v15.19,22.23 15.19,21.16 15.06,21.03 J7.8
  Route15 0.152: v23.65,15.75 23.65,19.78 21,22.43 16.73,22.43 16.56,22.26 16.1,22.26 16.09,22.28 15.19,22.28 v15.19,22.23
ADC1_IN10  (via drill 0.3 pad 0.6)
  Top 0.152: R4.2 3.59,13.5 v4.06,13.97 | IC1.9 25.8,5.67 25.8,4.99 26.3,4.49 v26.3,4.02
  Route15 0.152: v4.06,13.97 3.73,14.3 3.73,18.88 4.17,19.32 6.53,19.32 7.32,18.54 7.32,14.57 8.4,13.49 8.59,13.49 v8.64,13.45
  Bottom 0.152: v26.3,4.02 26.29,4 26.29,2.67 25.45,1.83 22.53,1.83 21.15,0.46 11.49,0.46 11.05,0.89 11.05,1.6 8.36,4.3 7.98,4.3 3.77,8.51 1.33,8.51 0.88,8.96 0.88,10.52 4.06,13.71 v4.06,13.97 | J1.A5 7.39,13.26 8.04,13.26 8.23,13.45 v8.64,13.45
ADC2_IN11  (via drill 0.3 pad 0.6)
  Top 0.152: R3.2 4.15,14.69 J1.B5 | IC1.8 25.15,4.93 25.45,4.63 v25.45,4.02
  Bottom 0.152: J1.B5 5.25,13.87 3.88,12.49 3.88,8.93 8.15,4.66 8.53,4.66 11.4,1.78 11.4,1.04 11.64,0.81 20.98,0.81 22.38,2.21 25.3,2.21 25.45,2.36 v25.45,4.02
D/G-EXT_PWM_1  (via drill 0.3 pad 0.6)
  Top 0.152: IC1.42 24.78,17.19 24.78,17.87 24.92,18.01 25.86,18.01 v26.19,18.34 | v16.28,22.89 16.33,22.84 J7.7
  Route15 0.152: v26.19,18.34 26.09,18.24 21.44,22.89 v16.28,22.89
D/G-EXT_PWM_2  (via drill 0.3 pad 0.6)
  Top 0.152: IC1.40 25.65,16.12 23.58,14.05 23.58,13.59 24.84,12.33 24.84,11.96 25.4,11.4 v25.4,10.44
  Bottom 0.152: v25.4,10.44 25.73,10.11 25.73,7.8 25.91,7.62 OK1.5
GND  (via drill 0.3 pad 0.6)
  Top 0.152: 2.03,15.2 R3.1 1.78,15.02 v1.78,13.97 1.78,13.72 1.99,13.5 R4.1 1.99,11.89 C3.2 5.66,10.79 J1.B12 | 2.16,6.35 LED3.C 1.49,7.11 v1.39,7.11 1.61,7.11 LED1.C | J7.S2 8.8,23.91 7.37,23.91 | v7.49,24.06 7.49,24.04 7.37,23.91 | LED2.C 6.31,22.85 7.37,23.91 | C21.2 10.71,21.04 10.41,21.34 v12.19,23.11 | J7.6 17.58,19.57 17.58,21.21 v18.14,21.77 | J7.4 20.05,19.6 20.05,21.22 19.51,21.77 v18.14,21.77 | IC2.2 IC2.1 8.45,9.69 9.48,9.69 IC2.GND@3 | IC3.17 12.73,12.73 IC3.GND@3 | IC3.GND@3 14.2,14.2 14.2,12.21 IC3.20 14.23,11.43 v14.48,11.18 | IC3.24 16.2,12.2 16.2,12.77 14.5,14.48 IC3.GND@3 | IC3.26 15.73,13.23 IC3.GND@3 | IC3.GND@3 14.48,16.06 14.71,16.29 14.71,16.75 IC3.4 | C16.2 C20.2 29.15,19.79 29.54,19.79 v29.87,19.46 | C10.2 31.31,16.73 30.84,16.26 v30.48,16.26 | C22.2 33.4,19.1 v33.61,19.3 | C11.2 32.51,14.32 v32.51,13.46 32.51,12.67 32.07,12.23 32.07,11.39 32.42,11.04 R11.1 32.55,10.67 C13.2 | C23.2 32.65,7.37 31.84,8.18 IC1.18 30.05,8.18 29.54,8.69 28.53,8.69 28.32,8.48 v28.25,8.48 27.15,7.38 IC1.12 | C24.2 15.96,1.81 16.68,1.09 17.82,1.09 18.54,1.82 SW1.4 20.28,1.82 | 20.28,1.82 v20.32,1.78 | SW1.2 20.28,1.82 | C26.2 14.13,7.74 v13.99,7.89 | v12.01,1.78 10.9,1.78 D1.2 8.7,1.8 C1.2 8.27,1.67 | IC1.63 23.23,8.18 v23.83,7.58 | J7.2 22.6,21.14 21.64,22.1 18.47,22.1 v18.14,21.77 | C2.2 8.71,4.7 v8.99,4.98 | v17.86,4.72 17.42,4.72 17.31,4.84 C25.2 | v29.21,23.61 27.27,23.61 J7.S1 27.05,22.21 C17.2
  Bottom 0.152: J1.B1 6,16.64 J1.A12 8.51,16.64 9.25,15.9 WIFI1.P$13 | WIFI1.P$19 18.2,18.52 18.18,18.54 18.18,21.73 v18.14,21.77 | WIFI1.P$18 11.91,23.4 v12.19,23.11 | 31.64,18.14 J4.2@2 31.64,17.67 J4.NC | J4.NC 33.27,19.3 v33.61,19.3 | J4.2@1 32.64,18.66 J4.NC | J5.NC 31.64,11.45 J5.2@2 | J5.NC 32.64,12.43 J5.2@1 | J5.NC 32.64,13.34 v32.51,13.46 | v27.91,10.39 27.91,11.51 WIFI1.P$9 | OK1.4 27.13,6.35 27.89,7.11 27.89,8.12 v28.25,8.48 | J6.2 24.1,7.31 v23.83,7.58 23.8,7.61 | C15.2 C7.2 | C7.2 19.36,8.79 18.51,8.79 17.98,9.31 C8.2 | C8.2 17.91,9.16 | 10,5.08 J2.2 9.79,4.98 v8.99,4.98 | C18.2 14.88,7.03 14.02,7.89 v13.99,7.89 | C7.2 21.23,8.21 | v17.86,4.72 17.61,4.72 16.89,5.44 C19.2 17.38,5.93 18.61,7.16 18.88,7.16 C7.2 | C6.2 14.11,8.69 14.11,8.02 v13.99,7.89 | C14.2 12.61,8.18 12.89,7.89 v13.99,7.89 | J1.A1 6,11.14 J1.B12 | C12.2 30.12,17.86 29.9,18.09 29.9,19.43 v29.87,19.46 | C8.2 C9.2 | C4.2 1.72,7.11 v1.39,7.11
  pour Route2: 0.25,24.89 0.25,0 35.05,0 35.05,24.89
N$1
  Top 0.152: J3.3 10.35,6.16 10.35,5.97 9.94,5.55 8.09,5.55 7.68,5.97 7.68,7.69 7.49,7.87 R1.1
  Bottom 0.152: J2.1 11.14,6.51 J3.3
N$2
  Top 0.152: R1.2 3.98,7.87 LED1.A
N$3
  Top 0.152: D1.1 11.62,5.21 11.62,7.5 11.21,7.91 10.63,7.91 10.22,7.5 10.22,7.3 J3.2
N$4
  Top 0.152: D1.3 10.75,3.17 L1.1 9,3.1 8.36,3.1 6.82,1.56 C1.1
N$6
  Top 0.152: LED2.A R2.2
N$7
  Top 0.152: C16.1 28.77,18.06 29.41,18.06 29.72,17.74 29.72,14.89 29.93,14.68 IC1.31
N$9  (via drill 0.3 pad 0.6)
  Top 0.152: J1.B6 6.8,15.14 8.9,15.14 R5.1 8.71,14.22 v8.61,14.33
  Bottom 0.152: v8.61,14.33 7.92,13.64 J1.A6
N$10
  Top 0.152: IC1.47 22.15,17.88 22.48,18.21 24.59,18.21 25.45,19.07 26.34,19.07 26.67,18.75 C17.1
N$11
  Top 0.152: J1.C_RRIGHT J1.C_FRIGHT 2.2,16.8 1.12,15.72 1.12,10.45 2.29,9.29 | J1.C_RLEFT 2.29,9.29 | 2.29,9.29 J1.C_FLEFT 1.99,9.5 C3.1
N$12  (via drill 0.3 pad 0.6)
  Top 0.152: R6.1 v9.09,12.36
  Bottom 0.152: J1.B7 6.09,13.49 6.62,14.01 7.14,14.01 J1.A7 7.78,14.14 8.04,14.39 8.04,14.71 8.26,14.92 8.81,14.92 9.24,14.49 9.24,12.51 v9.09,12.36
N$13
  Top 0.152: R7.1 LED3.A
N$14  (via drill 0.3 pad 0.6)
  Top 0.152: R11.2 33.6,10.65 33.37,10.65 32.72,10 32.28,10 32.12,9.84 32.12,8.98 32.75,8.35 33.71,8.35 34.33,7.74 34.33,5.95 33.83,5.46 v33.81,5.46
  Bottom 0.152: v33.81,5.46 33.1,6.17 OK1.3
N$15  (via drill 0.3 pad 0.6)
  Top 0.152: v28.45,7.63 27.66,6.84 IC1.13
  Route15 0.152: v22.61,9.88 23.16,9.88 25.41,7.63 v28.45,7.63
  Bottom 0.152: C14.1 12.29,10.17 19.96,10.17 20.81,9.31 C15.1 21.39,9.31 22.07,8.64 L2.1 22.42,9.7 v22.61,9.88
N$16  (via drill 0.3 pad 0.6)
  Top 0.152: Q1.1 12.76,7.35 v12.24,6.83
  Bottom 0.152: v12.24,6.83 12.61,7.2 R8.1 13.83,7.2 14.56,6.47 15.61,6.47 16.16,7.03 C19.1
N$17  (via drill 0.3 pad 0.6)
  Top 0.152: Q1.2 16.96,8.73 14.94,6.71 v14.94,4.65 | IC1.5 23.5,5.96 23.5,6.64 22.66,7.49 v21.08,7.49
  Route15 0.152: v21.08,7.49 19.54,5.94 16.23,5.94 v14.94,4.65
  Bottom 0.152: v14.94,4.65 14.94,5.88 C18.1
N$18  (via drill 0.3 pad 0.6)
  Top 0.152: v34.37,8.48 33.92,8.93 R10.2
  Bottom 0.152: OK1.1 34.14,8.89 34.37,8.66 v34.37,8.48
N$19  (via drill 0.3 pad 0.6)
  Top 0.152: v8.46,17.83 7.95,17.83 6.31,19.47 R2.1 | J1.B9 7.44,11.2 7.44,9.68 v7.74,9.39
  Route15 0.152: J3.1 8.38,8.67 7.74,9.31 v7.74,9.39 | v8.46,17.83 7.67,17.04 7.67,15.54 8.23,14.99 9.45,14.99 10.13,14.3 10.13,11.89 9.91,11.66 8.76,11.66 8.29,12.13 v8.29,12.65
  Bottom 0.152: J1.B9 6,12.64 J1.A4 7.99,12.64 8,12.65 v8.29,12.65
N$20  (via drill 0.3 pad 0.6)
  Top 0.152: IC1.6 24.16,6.87 24.59,7.3 24.59,7.62 v23.77,8.43
  Route15 0.152: v11.94,4.04 12.7,3.28 18.62,3.28 v23.77,8.43
  Bottom 0.152: R8.2 13.21,5.31 v11.94,4.04
N$21  (via drill 0.3 pad 0.6)
  Top 0.152: v34.35,16.05 34.21,15.9 34.21,10.29 33.99,10.07 33.34,10.07 32.73,9.45 R10.1
  Bottom 0.152: v34.35,16.05 33.27,16.05 J4.1
N$23  (via drill 0.3 pad 0.6)
  Top 0.152: v29.9,5.54 29.9,5.29 28.92,4.32 R12.2
  Bottom 0.152: v29.9,5.54 29.06,4.7 22.94,4.7 22.85,4.79 J6.3
N$25  (via drill 0.3 pad 0.6)
  Top 0.152: R14.2 25.49,3.19 24.64,4.04 24.64,4.15 v24.59,4.15
  Route15 0.152: v20.3,4.12 20.3,4.12 21.31,5.12 24.11,5.12 24.61,4.62 24.61,4.17 v24.59,4.15
  Bottom 0.152: v20.3,4.12 20.3,5.87 J6.5
NRST  (via drill 0.3 pad 0.6)
  Top 0.152: IC1.7 24.64,4.96 24.33,4.65 23.62,4.65 23.19,4.22 23.19,3.86 SW1.1 24.25,3.52 v24.77,3 | SW1.3 18.52,3.52 18.52,6.2 18.11,6.6 17.55,6.6 17.25,6.91 17.25,7.63 18.18,8.57 18.18,10.97 18.91,11.69 19.78,11.69 IC1.56 | C24.1 17.11,1.96 R16.2 17.31,3.38 18.24,3.38 SW1.3 | v19.43,2.69 18.41,2.69 18.34,2.77 18.34,3.39 18.25,3.39 SW1.3
  Route15 0.152: v19.43,2.69 24.45,2.69 v24.77,3
  Bottom 0.152: J6.6 19.43,5.6 v19.43,2.69
PC11_DOUT  (via drill 0.3 pad 0.6)
  Top 0.152: IC3.11 11.71,15.23 11.6,15.34 11.6,16.89 v11.63,16.92 | IC1.52 19.78,13.7 18.97,13.7 18.42,13.15 18.42,12.72 17.82,12.13 v17.78,12.13
  Route15 0.152: v11.63,16.92 12.99,16.92 v17.78,12.13
PC12_DOUT
  Top 0.152: IC1.53 19.78,13.19 18.97,13.19 18.77,13 18.77,12.14 18.11,11.47 15.49,11.47 15.23,11.74 IC3.22
PWM_ADC_GEXT_1  (via drill 0.3 pad 0.6)
  Top 0.152: IC1.23 31,10.68 30.24,10.68 26.62,14.3 v26.57,14.3 | v13.87,22.84 13.87,19.62 J7.9
  Bottom 0.152: v26.57,14.3 26.58,14.31 25.5,15.39 25.5,21.31 22.81,24 15.04,24 v13.87,22.84
PWM_ADC_GEXT_2  (via drill 0.3 pad 0.6)
  Top 0.152: IC1.22 30.23,10.19 27.33,13.08 26.74,13.08 v26.52,13.3 | v12.5,21.31 12.52,21.29 J7.10
  Bottom 0.152: v12.5,21.31 13.27,22.08 14.05,22.08 15.54,23.57 22.68,23.57 25.15,21.11 25.15,15.24 26.02,14.37 26.02,13.8 v26.52,13.3
PWM_ADC_GEXT_3  (via drill 0.3 pad 0.6)
  Top 0.152: v29.68,12.47 29.96,12.19 IC1.26
  Bottom 0.152: J5.1 32.59,10.4 32.16,10.4 32.16,10.41 30.79,10.41 29.64,11.56 29.64,12.43 v29.68,12.47
SWCLK  (via drill 0.3 pad 0.6)
  Top 0.152: v21.61,3.4 22.63,2.39 24.99,2.39 25.21,2.62 26.78,2.62 R17.1 | v22.78,13.46 22.33,13.46 20.6,15.19 IC1.49
  Bottom 0.152: v21.61,3.4 21.61,3.56 22.14,4.09 22.14,4.55 21.74,4.95 21.74,5.79 J6.4 21.6,7.22 21.83,7.46 22.94,7.46 23.2,7.71 23.2,13.05 v22.78,13.46
SWDIO  (via drill 0.3 pad 0.6)
  Top 0.152: R12.1 28.8,3.11 28.8,2.66 R15.1 28.83,3.22 29.34,3.72 29.34,4.21 31.15,6.02 v31.3,6.02 | IC1.46 22.66,15.63 22.05,15.03 v22.05,14.7
  Route15 0.152: v22.05,14.7 22.05,12.5 24.77,9.79 29.88,9.79 31.8,7.86 31.8,6.52 v31.3,6.02
SWO  (via drill 0.3 pad 0.6)
  Top 0.152: R13.1 27.81,2.68 27.12,1.99 R14.1 25.15,1.99 24.95,1.79 24.95,0.9 25.33,0.51 29.39,0.51 v29.54,0.66 | IC1.55 20.7,12.19 21.29,11.61 v24.38,11.61
  Route15 0.152: v24.38,11.61 24.49,11.61 24.59,11.51 29.95,11.51 32.18,9.27 32.18,5.65 29.69,3.16 29.69,0.81 v29.54,0.66
SX_DAC0  (via drill 0.3 pad 0.6)
  Top 0.152: IC1.21 30.21,9.68 27.24,12.65 26.27,12.65 v25.58,13.34 | v21.29,21.16 21.35,21.09 J7.3
  Bottom 0.152: v21.29,21.16 21.46,21.34 23.75,21.34 24.8,20.29 24.8,15.04 25.58,14.26 v25.58,13.34
SY_DAC1  (via drill 0.3 pad 0.6)
  Top 0.152: v25.5,12.47 25.68,12.29 27.09,12.29 30.23,9.16 IC1.20 | v19,21.14 18.85,20.99 J7.5
  Bottom 0.152: v25.5,12.47 25.03,12.95 25.03,14.3 24.42,14.91 24.42,19.42 24,19.84 21.38,19.84 21.33,19.78 19.97,21.14 v19,21.14
UART2_CTS  (via drill 0.3 pad 0.6)
  Top 0.152: IC1.14 28.14,6.53 29.41,7.8 v29.57,7.8
  Bottom 0.152: v29.57,7.8 29.57,9.57 28.78,10.36 28.78,14.94 28.64,15.07 28.62,15.07 WIFI1.P$6
UART2_RTS  (via drill 0.3 pad 0.6)
  Top 0.152: IC1.15 28.65,6.53 29.16,7.04 v30,7.04
  Bottom 0.152: WIFI1.P$5 28.62,16.57 28.64,16.57 30.02,15.2 30.02,13.81 29.13,12.92 29.13,10.51 30.12,9.51 30.12,7.16 v30,7.04
UART2_RXD  (via drill 0.3 pad 0.6)
  Top 0.152: IC1.17 31.01,7.01 v31.16,6.87
  Route15 0.152: v31.16,6.87 31.03,7 31.03,8.11 29.71,9.42 24.63,9.42 23.24,10.81 15.88,10.81 10.95,15.75 v8.36,15.75
  Bottom 0.152: WIFI1.P$12 9.48,15.22 9.43,15.22 8.9,15.75 v8.36,15.75
UART2_TXD  (via drill 0.3 pad 0.6)
  Top 0.152: IC1.16 29.16,6.2 29.23,6.27 v30.38,6.27
  Route15 0.152: v30.38,6.27 30.38,6.54 30.57,6.73 30.57,7.98 29.49,9.07 24.48,9.07 23.09,10.46 9.14,10.46 v8.91,10.68
  Bottom 0.152: v8.91,10.68 8.93,10.7 11.24,10.7 11.4,10.86 11.4,12.04 10.55,12.9 WIFI1.P$11
UART3_CTS  (via drill 0.3 pad 0.6)
  Top 0.152: IC3.32 16.8,16.2 17.19,16.2 17.76,15.64 17.76,15.16 17.78,15.14 17.78,14.73 v18.03,14.47 | IC1.34 28.65,15.96 27.63,14.94 25.22,14.94 24.13,13.85 v24.13,13.82
  Bottom 0.152: v18.03,14.47 18.47,14.04 23.88,14.04 24.09,13.82 v24.13,13.82
UART3_RTS  (via drill 0.3 pad 0.6)
  Top 0.152: IC3.8 12.73,17.72 12.27,18.18 v11.6,18.18 | v26.42,15.62 27.81,15.62 28.14,15.95 IC1.35
  Route15 0.152: v11.6,18.18 16.87,18.18 19.39,15.67 21.43,15.67 21.54,15.77 22.71,15.77 23.32,15.16 24.05,15.16 24.49,15.6 26.39,15.6 v26.42,15.62
UART3_RXD  (via drill 0.3 pad 0.6)
  Top 0.152: v29.46,14.22 29.52,14.17 IC1.30 | IC3.30 17.09,15.23 17.35,14.97 17.35,13.85 v17.81,13.39
  Route15 0.152: v17.81,13.39 18.22,13.39 20.14,15.31 21.66,15.31 21.74,15.39 22.56,15.39 23.19,14.76 24.16,14.76 24.37,14.97 28.72,14.97 v29.46,14.22
UART3_TXD  (via drill 0.3 pad 0.6)
  Top 0.152: IC3.2 15.73,17.22 15.99,17.48 19.54,17.48 20.55,16.47 20.83,16.47 v20.92,16.37 | v23.75,12.37 22.81,12.37 20.98,14.2 19.81,14.2 IC1.51
  Bottom 0.152: v23.75,12.37 23.75,12.62 24.66,13.54 24.66,14.14 23.97,14.83 23.26,14.83 21.9,16.19 21.1,16.19 v20.92,16.37
USB_D+
  Top 0.152: IC3.14 12.1,13.8 11.79,13.8 11.37,14.22 R5.2
USB_D-
  Top 0.152: R6.2 11.16,13.23 IC3.15
WIFI_RST  (via drill 0.3 pad 0.6)
  Top 0.152: C20.1 28.83,20.61 v29.02,20.61 29.53,20.61 30.43,19.71 30.43,18.53 R9.1
  Bottom 0.152: WIFI1.P$2 28.8,21.9 29.01,21.69 29.01,20.63 v29.02,20.61

### Text on the board
tNames: USB | EXT | 3V3